# Altium schematic sheet Tespen.SchDoc
size A4
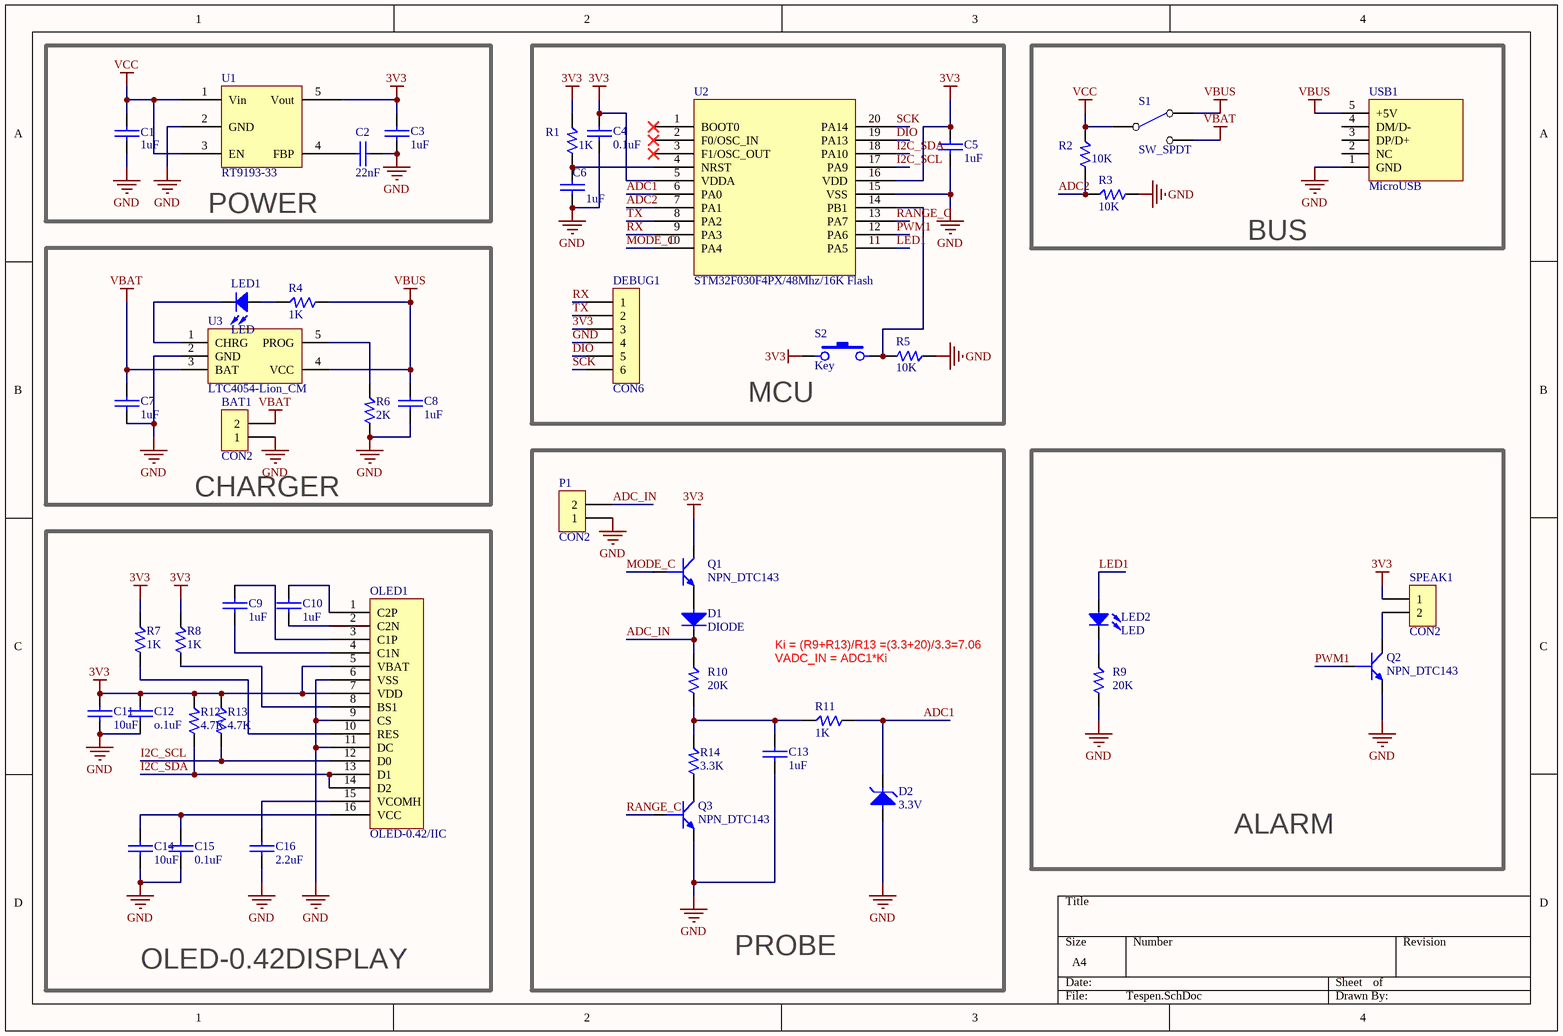
[diagram p0: Tespen.SchDoc]

## Parts
BAT1  CON2  [SIP2]
C1  1uF  [0603C]
C2  22nF  [0603C]
C3  1uF  [0603C]
C4  0.1uF  [0603C]
C5  1uF  [0603C]
C6  1uF  [0603C]
C7  1uF  [0603C]
C8  1uF  [0603C]
C9  1uF  [0603C]
C10  1uF  [0603C]
C11  10uF  [0603C]
C12  o.1uF  [0603C]
C13  1uF  [0603C]
C14  10uF  [0603C]
C15  0.1uF  [0603C]
C16  2.2uF  [0603C]
D1  DIODE  [SOD-123]
D2  3.3V  [SOD-123]
DEBUG1  CON6  [SIP6]
LED1  LED  [1206D]
LED2  LED  [1206D]
OLED1  OLED-0.42/IIC
P1  CON2  [KF508V-2]
Q1  NPN_DTC143  [SOT-523]
Q2  NPN_DTC143  [SOT-523]
Q3  NPN_DTC143  [SOT-523]
R1  1K  [0603]
R2  10K  [0603]
R3  10K  [0603]
R4  1K  [0603]
R5  10K  [0603]
R6  2K  [0603]
R7  1K  [0603]
R8  1K  [0603]
R9  20K  [0603]
R10  20K  [0603]
R11  1K  [0603]
R12  4.7K  [0603]
R13  4.7K  [0603]
R14  3.3K  [0603]
S1  SW_SPDT
S2  Key  [KEY_DIP]
SPEAK1  CON2  [KF508V-2]
U1  RT9193-33  [SOT-23-5]
U2  STM32F030F4PX/48Mhz/16K Flash  [TSSOP20-44]
U3  LTC4054-Lion_CM
USB1  MicroUSB  [USB/Mic-5SB]

## Blocks framed on the sheet
POWER: C1-C3 U1
MCU: C4-C6 DEBUG1 R1 R5 S2 U2
BUS: R2 R3 S1 USB1
CHARGER: BAT1 C7 C8 LED1 R4 R6 U3
PROBE: C13 D1 D2 P1 Q1 Q3 R10 R11 R14
ALARM: LED2 Q2 R9 SPEAK1
OLED-0.42DISPLAY: C9-C12 C14-C16 OLED1 R7 R8 R12 R13

## Nets
3V3: C3.1 C4.1 C5.1 C11.1 C12.1 DEBUG1.3 OLED1.5(VBAT) OLED1.7(VDD) Q1.3 R1.2 R7.2 R8.2 R12.2 R13.2 S2.1 SPEAK1.1 U1.5(Vout) U2.5(VDDA) U2.16(VDD)
GND: BAT1.1 C1.2 C2.2 C3.2 C4.2 C5.2 C6.2 C7.2 C8.2 C11.2 C12.2 C13.2 C14.2 C15.2 C16.2 D2.1 DEBUG1.4 OLED1.6(VSS) OLED1.9(CS) OLED1.11(DC) P1.1 Q2.2 Q3.2 R3.1 R5.2 R6.1 R9.1 U1.2(GND) U2.15(VSS) U3.2(GND) USB1.1(GND)
VBAT: BAT1.2 C7.1 S1.3(NO) U3.3(BAT)
VBUS: C8.1 R4.1 S1.2(NC) U3.4(VCC) USB1.5(+5V)
VCC: C1.1 R2.2 S1.1(COMMON) U1.1(Vin) U1.3(EN)
ADC1: D2.2 R11.1 U2.6(PA0)
ADC2: R2.1 R3.2 U2.7(PA1)
ADC_IN: D1.2 P1.2 R10.2
DIO: DEBUG1.5 U2.19(PA13)
I2C_SCL: OLED1.12(D0) R13.1 U2.17(PA9)
I2C_SDA: OLED1.13(D1) OLED1.14(D2) R12.1 U2.18(PA10)
LED1: LED2.1 U2.11(PA5)
MODE_C: Q1.1 U2.10(PA4)
PWM1: Q2.1 U2.12(PA6)
RANGE_C: Q3.1 U2.13(PA7)
RX: DEBUG1.1 U2.9(PA3)
SCK: DEBUG1.6 U2.20(PA14)
TX: DEBUG1.2 U2.8(PA2)
NetC2_1: C2.1 U1.4(FBP)
NetC6_1: C6.1 R1.1 U2.4(NRST)
NetC9_1: C9.1 OLED1.3(C1P)
NetC9_2: C9.2 OLED1.4(C1N)
NetC10_1: C10.1 OLED1.1(C2P)
NetC10_2: C10.2 OLED1.2(C2N)
NetC13_1: C13.1 R10.1 R11.2 R14.2
NetC14_1: C14.1 C15.1 OLED1.16(VCC)
NetC16_1: C16.1 OLED1.15(VCOMH)
NetD1_1: D1.1 Q1.2
NetLED1_1: LED1.1 R4.2
NetLED1_2: LED1.2 U3.1(CHRG)
NetLED2_2: LED2.2 R9.2
NetOLED1_8: OLED1.8(BS1) R8.1
NetOLED1_10: OLED1.10(RES) R7.1
NetQ2_3: Q2.3 SPEAK1.2
NetQ3_3: Q3.3 R14.1
NetR5_1: R5.1 S2.2 U2.14(PB1)
NetR6_2: R6.2 U3.5(PROG)

Not connected (* = marked no-connect by the designer): U2 1(BOOT0)* 2(F0/OSC_IN)* 3(F1/OSC_OUT)*; USB1 2(NC) 3(DP/D+) 4(DM/D-)

## Notes on the sheet
- Ki = (R9+R13)/R13 =(3.3+20)/3.3=7.06
- VADC_IN = ADC1*Ki

## Library data of the parts
BAT1 P1 SPEAK1 = CON2: Connector
C1-C16 = CAP: Capacitor
D2 = DIODE_ZENER: TVS
DEBUG1 = CON6: Connector
OLED1 = OLED-0.42-IIC: type: FPC16
R1-R14 = RES: Potentiometer
U1 = RT9193-xx
U2 = STM32F030F4PX
U3 = LTC4054
USB1 = USBmini